# EAGLE schematic Timer_CMD_REV2 (EAGLE 7.0.0)
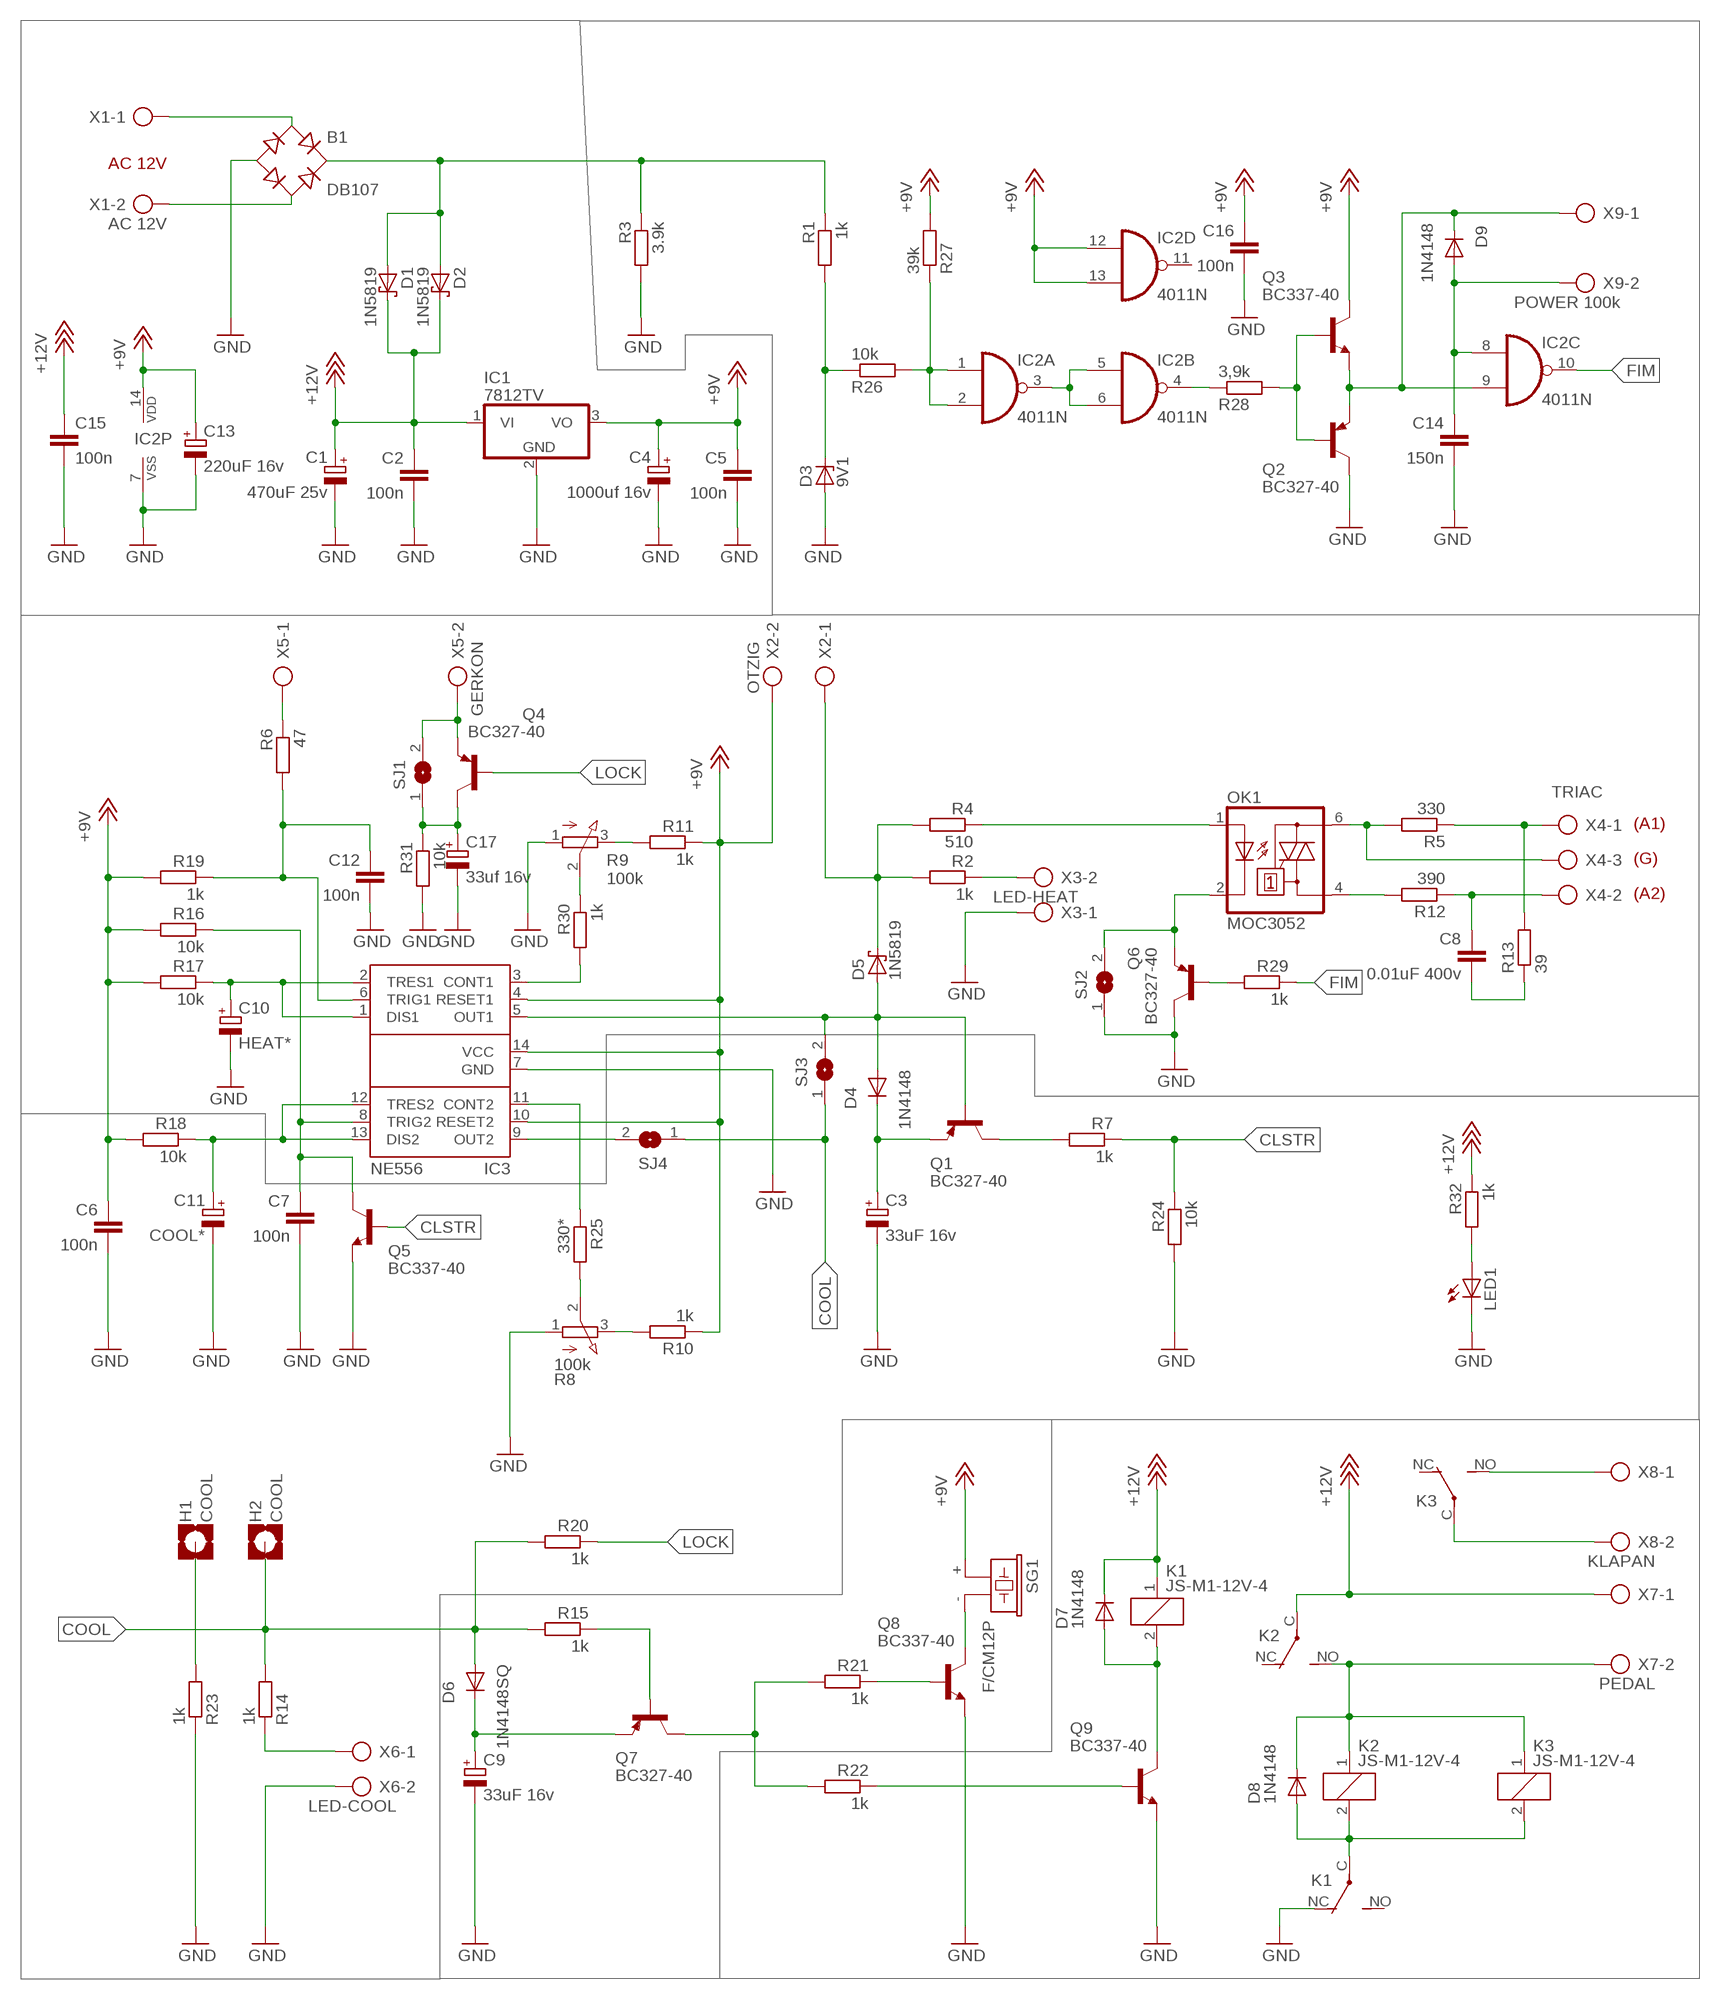
[diagram p0: schematic, sheet 1]

## Parts
B1  DB107  DBDB107G  [DB]
C1  470uF 25v  CPOL-EUE3.5-8  [E3,5-8]
C2  100n  C-EU050-035X075  [C050-035X075]
C3  33uF 16v  CPOL-EUE3.5-8  [E3,5-8]
C4  1000uf 16v  CPOL-EUE5-10.5  [E5-10,5]
C5  100n  C-EU050-035X075  [C050-035X075]
C6  100n  C-EU025-030X050  [C025-030X050]
C7  100n  C-EU025-030X050  [C025-030X050]
C8  0.01uF 400v  C-EU075-063X106  [C075-063X106]
C9  33uF 16v  CPOL-EUE3.5-8  [E3,5-8]
C10  HEAT*  CPOL-EUE3.5-10  [E3,5-10]
C11  COOL*  CPOL-EUE3.5-10  [E3,5-10]
C12  100n  C-EU025-030X050  [C025-030X050]
C13  220uF 16v  CPOL-EUE3.5-8  [E3,5-8]
C14  150n  C-EU050-035X075  [C050-035X075]
C15  100n  C-EU050-035X075  [C050-035X075]
C16  100n  C-EU050-035X075  [C050-035X075]
C17  33uf 16v  CPOL-EUE2.5-6  [E2,5-6]
D1  1N5819  1N5819-T  [DO41-7.6]
D2  1N5819  1N5819-T  [DO41-7.6]
D3  9V1  1N4728_  [DO41Z12]
D4  1N4148  1N4148S  [DO35-7SQ]
D5  1N5819  1N5819-T  [DO41-7.6]
D6  1N4148SQ  [DO35-10_SQ]
D7  1N4148  1N4148S  [DO35-7SQ]
D8  1N4148  1N4148S  [DO35-7SQ]
D9  1N4148  1N4148S  [DO35-7SQ]
H1  COOL  MOUNT-PAD-SQUARE  [4MM-PAD-SQUARE]
H2  COOL  MOUNT-PAD-SQUARE  [4MM-PAD-SQUARE]
IC1  7812TV  [TO220V]
IC2  4011N  [DIL14]
IC3  NE556  [DIL14]
K1  JS-M1-12V-4  [JS-M]
K2  JS-M1-12V-4  [JS-M]
K3  JS-M1-12V-4  [JS-M]
LED1  LED3MM  [LED3MM]
OK1  MOC3052  MOC3042M  [DIL06]
Q1  BC327-40  [TO92-EBC]
Q2  BC327-40  [TO92-EBC]
Q3  BC337-40  BC338-40  [TO92-EBC]
Q4  BC327-40  [TO92-EBC]
Q5  BC337-40  BC338-40  [TO92-EBC]
Q6  BC327-40  [TO92-EBC]
Q7  BC327-40  [TO92-EBC]
Q8  BC337-40  BC338-40  [TO92-EBC]
Q9  BC337-40  BC338-40  [TO92-EBC]
R1  1k  R-EU_0207/10  [0207/10]
R2  1k  R-EU_0207/10  [0207/10]
R3  3.9k  R-EU_0207/10  [0207/10]
R4  510  R-EU_0207/10  [0207/10]
R5  330  R-EU_0207/10  [0207/10]
R6  47  R-EU_0207/10  [0207/10]
R7  1k  R-EU_0207/10  [0207/10]
R8  100k  3RP/1610N  [3RP/1610N]
R9  100k  3RP/1610N  [3RP/1610N]
R10  1k  R-EU_0207/10  [0207/10]
R11  1k  R-EU_0207/10  [0207/10]
R12  390  R-EU_0207/10  [0207/10]
R13  39  R-EU_0411/12  [0411/12]
R14  1k  R-EU_0207/10  [0207/10]
R15  1k  R-EU_0207/10  [0207/10]
R16  10k  R-EU_0207/10  [0207/10]
R17  10k  R-EU_0207/10  [0207/10]
R18  10k  R-EU_0207/10  [0207/10]
R19  1k  R-EU_0207/10  [0207/10]
R20  1k  R-EU_0207/10  [0207/10]
R21  1k  R-EU_0207/10  [0207/10]
R22  1k  R-EU_0207/10  [0207/10]
R23  1k  R-EU_0207/10  [0207/10]
R24  10k  R-EU_0207/10  [0207/10]
R25  330*  R-EU_0207/10  [0207/10]
R26  10k  R-EU_0207/10  [0207/10]
R27  39k  R-EU_0207/10  [0207/10]
R28  3,9k  R-EU_0207/10  [0207/10]
R29  1k  R-EU_0207/10  [0207/10]
R30  1k  R-EU_0207/11  [0207/11]
R31  10k  R-EU_0207/10  [0207/10]
R32  1k  R-EU_0207/10  [0207/10]
SG1  F/CM12P  [F/CM12P]
SJ1  SJ  [SJ]
SJ2  SJ  [SJ]
SJ3  SJ  [SJ]
SJ4  SJ  [SJ]
X1  AC 12V  AK500/2  [AK500/2]
X2  OTZIG  AK500/2  [AK500/2]
X3  LED-HEAT  AK500/2  [AK500/2]
X4  TRIAC  AK500/3  [AK500/3]
X5  GERKON  AK500/2  [AK500/2]
X6  LED-COOL  AK500/2  [AK500/2]
X7  PEDAL  AK500/2  [AK500/2]
X8  KLAPAN  AK500/2  [AK500/2]
X9  POWER 100k  AK500/2  [AK500/2]

## Nets
788: Q1.C R7.2
+9V: C4.+ C5.1 C6.1 C13.+ C16.1 IC1.3(VO) IC2.12(D:I0) IC2.13(D:I1) IC2.14(P:VDD) IC3.4(RESET1) IC3.10(RESET2) IC3.14(VCC) Q3.C R10.1 R11.1 R16.2 R17.2 R18.2 R19.2 R27.2 SG1.+ X2.2
+12V: C1.+ C2.1 C15.1 D1.C D2.C D7.C IC1.1(VI) K1.1 K2.C(2:P) R32.1 X7.1
CLSTR: Q5.B R7.1 R24.1
COOL: D6.A H2.B2,8(MOUNT) R14.2 R15.2 R20.2 SJ3.1 SJ4.1
FIM: IC2.10(C:O) R29.1
GND: B1.- C1.- C2.2 C3.- C4.- C5.2 C6.2 C7.2 C9.- C10.- C11.- C12.2 C13.- C14.2 C15.2 C16.2 C17.- D3.A IC1.2(GND) IC2.7(P:VSS) IC3.7(GND) K1.NC(2:O) LED1.K(C) Q2.C Q5.E Q6.C Q8.E Q9.E R3.2 R8.1(A) R9.1(A) R23.1 R24.2 R31.2 SJ2.1 X3.1 X6.2
LOCK: Q4.B R20.1
N$1: B1.+ D1.A D2.A R1.1 R3.1
N$2: R6.1 X5.1
N$3: R2.1 X3.2
N$5: OK1.4(A1) R12.2
N$6: D3.C R1.2 R26.1
N$7: D5.C R2.2 R4.2 X2.1
N$8: C8.1 R12.1 X4.2
N$11: C10.+ IC3.1(DIS1) IC3.2(TRES1) R17.1
N$12: B1.AC2 X1.2
N$13: B1.AC1 X1.1
N$14: D4.A D5.A IC3.5(OUT1) Q1.B SJ3.2
N$15: OK1.2(C) Q6.E SJ2.2
N$18: R5.1 R13.2 X4.1
N$19: C8.2 R13.1
N$20: Q7.B R15.1
N$22: Q7.C R21.2 R22.2
N$23: D7.A K1.2 Q9.C
N$24: Q8.B R21.1
N$25: C11.+ IC3.12(TRES2) IC3.13(DIS2) R18.1
N$28: C12.1 IC3.6(TRIG1) R6.2 R19.1
N$29: R9.3(E) R11.2
N$30: IC3.11(CONT2) R25.1
N$31: Q4.E SJ1.2 X5.2
N$32: R8.3(E) R10.2
N$33: IC2.1(A:I0) IC2.2(A:I1) R26.2 R27.1
N$35: Q9.B R22.1
N$36: D8.C K2.1 K2.NO(2:S) K3.1 X7.2
N$37: Q8.C SG1.-
N$38: OK1.6(A2) R5.2 X4.3
N$39: C3.+ D4.C Q1.E
N$40: D8.A K1.C(2:P) K2.2 K3.2
N$41: K3.NO(2:S) X8.1
N$42: R14.1 X6.1
N$43: H1.B2,8(MOUNT) R23.2
N$48: IC3.3(CONT1) R30.2
N$53: IC3.9(OUT2) SJ4.2
N$63: IC2.4(B:O) R28.1
N$64: IC2.3(A:O) IC2.5(B:I0) IC2.6(B:I1)
N$65: OK1.1(A) R4.1
N$66: C7.1 IC3.8(TRIG2) Q5.C R16.1
N$67: Q2.B Q3.B R28.2
N$68: K3.C(2:P) X8.2
N$70: C14.1 D9.A IC2.8(C:I0) X9.2
N$71: Q6.B R29.2
N$74: R8.2(S) R25.2
N$76: D9.C IC2.9(C:I1) Q2.E Q3.E X9.1
N$82: C17.+ Q4.C R31.1 SJ1.1
N$83: C9.+ D6.C Q7.E
N$84: R9.2(S) R30.1
N$85: LED1.A R32.2
Unconnected: IC2.11(D:O) K1.NO(2:S) K2.NC(2:O) K3.NC(2:O)

## Notes on the sheet
- AC 12V
- (A1)
- (G)
- (A2)

## Library data of the parts
B1 = rectifier:DB?*G: Single Phase 1.0 AMP Glass Passivated Bridge Rectifier Taiwan Semiconductor Co.,Ltd. - TSC Source: http://www.taiwansemi.com/TSCbig5/ezcatfiles/cust/img/img/db101g.pdf http://www.ts.com.tw/db/pictures/modules/PDT/PDT060207001/DBLS201G.pdf
C1 C3 C4 C9-C11 C13 C17 = rcl:CPOL-EU: POLARIZED CAPACITOR, European symbol
C2 C5-C8 C12 C14-C16 = rcl:C-EU: CAPACITOR, European symbol
D1 D2 D5 = diode:1N581*: 1.0A SCHOTTKY BARRIER RECTIFIER Source: http://www.diodes.com/datasheets/ds23001.pdf
D3 = diode:1N4728: Z DIODE 3.3 V, 1W, 5 percent
D4 D6-D9 = diode:1N4148: DIODE high speed (Philips)
H1 H2 = holes:MOUNT-PAD-SQUARE: MOUNTING PAD, square
IC1 = linear:78*: Positive VOLTAGE REGULATOR Source: http://cache.national.com/ds/LM/LM78L05.pdf http://www.fairchildsemi.com/ds/LM/LM7805.pdf
IC2 = 40xx:4011: Quad 2-input NAND
IC3 = st-microelectronics:NE556: General Purpose Biopolartimer; MPN: NE556; OC_FARNELL: 2349784; OC_NEWARK: 83C0108
K1-K3 = relay:JS-M1*: Automotive Ultra-Miniature Power Relay NAiS Source: http://www.mew-europe.com/.. en_ds_61211_0000.pdf; MPN: JSM1-12V-4; OC_FARNELL: 910338; OC_NEWARK: 13P4552
LED1 = led:LED: LED OSRAM: - CHIPLED LG R971, LG N971, LY N971, LG Q971, LY Q971, LO R971, LY R971 LH N974, LH R974 LS Q976, LO Q976, LY Q976 LO Q996 - Hyper CHIPLED LW Q18S LB Q993, LB Q99A, LB R99A - SideLED LS A670, LO A670, LY A670, LG A670, LP A670 LB A673, LV A673, LT A673, LW A673 LH A674 LY A675 LS A676, LA A676, LO A676, LY A676, LW A676 LS A679, LY A679, LG A679 - Hyper Micro SIDELED® LS Y876, LA Y876, LO Y876, LY Y876 LT Y87S - SmartLED LW L88C, LW L88S LB L89C, LB L89S, LG L890 LS L89K, LO L89K, LY L89K LS L896, LA L896, LO L896, LY L896 - TOPLED LS T670, LO T670, LY T670, LG T670, LP T670 LSG T670, LSP T670, LSY T670, LOP T670, LYG T670 LG T671, LOG T671, LSG T671 LB T673, LV T673, LT T673, LW T673 LH T674 LS T676, LA T676, LO T676, LY T676, LB T676, LH T676, LSB T676, LW T676 LB T67C, LV T67C, LT T67C, LS T67K, LO T67K, LY T67K, LW E67C LS E67B, LA E67B, LO E67B, LY E67B, LB E67C, LV E67C, LT E67C LW T67C LS T679, LY T679, LG T679 LS T770, LO T770, LY T770, LG T770, LP T770 LB T773, LV T773, LT T773, LW T773 LH T774 LS E675, LA E675, LY E675, LS T675 LS T776, LA T776, LO T776, LY T776, LB T776 LHGB T686 LT T68C, LB T68C - Hyper Mini TOPLED® LB M676 - Mini TOPLED Santana® LG M470 LS M47K, LO M47K, LY M47K Source: http://www.osram.convergy.de LUXEON: - LUMILED® LXK2-PW12-R00, LXK2-PW12-S00, LXK2-PW14-U00, LXK2-PW14-V00 LXK2-PM12-R00, LXK2-PM12-S00, LXK2-PM14-U00 LXK2-PE12-Q00, LXK2-PE12-R00, LXK2-PE12-S00, LXK2-PE14-T00, LXK2-PE14-U00 LXK2-PB12-K00, LXK2-PB12-L00, LXK2-PB12-M00, LXK2-PB14-N00, LXK2-PB14-P00, LXK2-PB14-Q00 LXK2-PR12-L00, LXK2-PR12-M00, LXK2-PR14-Q00, LXK2-PR14-R00 LXK2-PD12-Q00, LXK2-PD12-R00, LXK2-PD12-S00 LXK2-PH12-R00, LXK2-PH12-S00 LXK2-PL12-P00, LXK2-PL12-Q00, LXK2-PL12-R00 Source: www.luxeon.com KINGBRIGHT: KA-3528ASYC Source: www.kingbright.com
OK1 = optocoupler:MOC30*: 6-Pin DIP Zero-Cross Optoisolators Triac Driver Output (250/400 Volt Peak) Source: Data sheet <http://www.fairchildsemi.com/ds/MO/MOC3031M.pdf> The old path of data sheet not more available 2013-05-06.; MF: FAIRCHILD SEMICONDUCTOR; MPN: MOC3042-M; OC_FARNELL: 1021368; OC_NEWARK: 72K8899
Q1 Q2 Q4 Q6 Q7 = transistor-pnp:BC327*: PNP Transistror
Q3 Q5 Q8 Q9 = transistor-npn:BC338*: NPN Transistor
R1-R7 R10-R32 = rcl:R-EU_: RESISTOR, European symbol
R8 R9 = pot:3RP/1610N: 16mm Potentiometer one level Source: http://www.alphapotentiometers.net/html/16mm_pot_2.html
SG1 = buzzer:F/CM12P: BUZZER Source: Buerklin; OC_FARNELL: unknown; OC_NEWARK: unknown
SJ1-SJ4 = jumper:SJ: SMD solder JUMPER
X1-X3 X5-X9 = con-ptr500:AK500/2: CONNECTOR; OC_FARNELL: unknown; OC_NEWARK: unknown
X4 = con-ptr500:AK500/3: CONNECTOR; OC_FARNELL: unknown; OC_NEWARK: unknown